# EAGLE design Loconet in-out v3 (EAGLE 7.2.0)
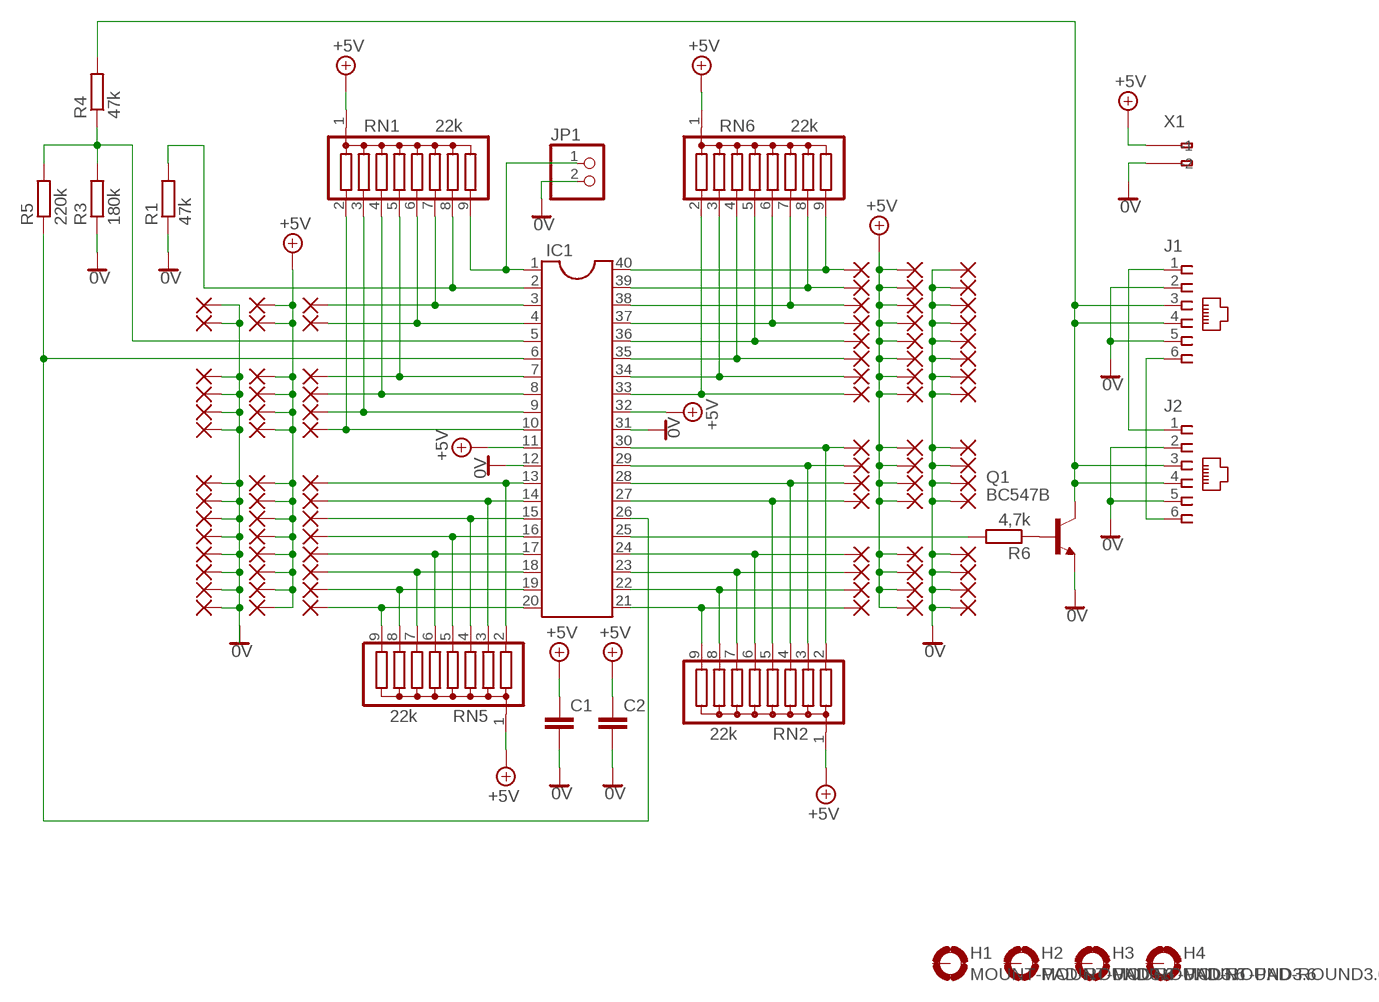
[diagram p0: schematic, sheet 1]

## Parts
0  2,15/1,0  [2,15/1,0]
1  1  2,15/1,0  [2,15/1,0]
2  2,15/1,0  [2,15/1,0]
3  2,15/1,0  [2,15/1,0]
4  2,15/1,0  [2,15/1,0]
5  2,15/1,0  [2,15/1,0]
6  2,15/1,0  [2,15/1,0]
7  2,15/1,0  [2,15/1,0]
8  2,15/1,0  [2,15/1,0]
9  2,15/1,0  [2,15/1,0]
10  2,15/1,0  [2,15/1,0]
11  2,15/1,0  [2,15/1,0]
12  2,15/1,0  [2,15/1,0]
13  2,15/1,0  [2,15/1,0]
14  2,15/1,0  [2,15/1,0]
15  2,15/1,0  [2,15/1,0]
16  2,15/1,0  [2,15/1,0]
17  2,15/1,0  [2,15/1,0]
18  2,15/1,0  [2,15/1,0]
19  2,15/1,0  [2,15/1,0]
20  2,15/1,0  [2,15/1,0]
21  2,15/1,0  [2,15/1,0]
22  2,15/1,0  [2,15/1,0]
23  2,15/1,0  [2,15/1,0]
24  2,15/1,0  [2,15/1,0]
25  2,15/1,0  [2,15/1,0]
26  2,15/1,0  [2,15/1,0]
27  2,15/1,0  [2,15/1,0]
28  2,15/1,0  [2,15/1,0]
29  2,15/1,0  [2,15/1,0]
30  2,15/1,0  [2,15/1,0]
C1  C-EU025-024X044  [C025-024X044]
C2  C-EU025-024X044  [C025-024X044]
H1  MOUNT-PAD-ROUND3.6  [3,6-PAD]
H2  MOUNT-PAD-ROUND3.6  [3,6-PAD]
H3  MOUNT-PAD-ROUND3.6  [3,6-PAD]
H4  MOUNT-PAD-ROUND3.6  [3,6-PAD]
IC1  DIL40  [DIL40]
J1  520250-3  [520250-3]
J2  520250-3  [520250-3]
JP1  PINHD-1X2  [1X02]
PAD1  2,15/1,0  [2,15/1,0]
PAD2  2,15/1,0  [2,15/1,0]
PAD3  2,15/1,0  [2,15/1,0]
PAD4  2,15/1,0  [2,15/1,0]
PAD5  2,15/1,0  [2,15/1,0]
PAD6  2,15/1,0  [2,15/1,0]
PAD7  2,15/1,0  [2,15/1,0]
PAD8  2,15/1,0  [2,15/1,0]
PAD9  2,15/1,0  [2,15/1,0]
PAD10  2,15/1,0  [2,15/1,0]
PAD11  2,15/1,0  [2,15/1,0]
PAD12  2,15/1,0  [2,15/1,0]
PAD13  2,15/1,0  [2,15/1,0]
PAD14  2,15/1,0  [2,15/1,0]
PAD15  2,15/1,0  [2,15/1,0]
PAD16  2,15/1,0  [2,15/1,0]
PAD17  2,15/1,0  [2,15/1,0]
PAD18  2,15/1,0  [2,15/1,0]
PAD19  2,15/1,0  [2,15/1,0]
PAD20  2,15/1,0  [2,15/1,0]
PAD21  2,15/1,0  [2,15/1,0]
PAD22  2,15/1,0  [2,15/1,0]
PAD23  2,15/1,0  [2,15/1,0]
PAD24  2,15/1,0  [2,15/1,0]
PAD25  2,15/1,0  [2,15/1,0]
PAD26  2,15/1,0  [2,15/1,0]
PAD27  2,15/1,0  [2,15/1,0]
PAD28  2,15/1,0  [2,15/1,0]
PAD29  2,15/1,0  [2,15/1,0]
PAD30  2,15/1,0  [2,15/1,0]
PAD33  2,15/1,0  [2,15/1,0]
PAD35  2,15/1,0  [2,15/1,0]
PAD37  2,15/1,0  [2,15/1,0]
PAD39  2,15/1,0  [2,15/1,0]
PAD41  2,15/1,0  [2,15/1,0]
PAD43  2,15/1,0  [2,15/1,0]
PAD52  2,15/1,0  [2,15/1,0]
PAD53  2,15/1,0  [2,15/1,0]
PAD54  2,15/1,0  [2,15/1,0]
PAD55  2,15/1,0  [2,15/1,0]
PAD56  2,15/1,0  [2,15/1,0]
PAD57  2,15/1,0  [2,15/1,0]
PAD58  2,15/1,0  [2,15/1,0]
PAD59  2,15/1,0  [2,15/1,0]
PAD60  2,15/1,0  [2,15/1,0]
PAD61  2,15/1,0  [2,15/1,0]
PAD62  2,15/1,0  [2,15/1,0]
PAD63  2,15/1,0  [2,15/1,0]
PAD64  2,15/1,0  [2,15/1,0]
PAD65  2,15/1,0  [2,15/1,0]
PAD66  2,15/1,0  [2,15/1,0]
PAD67  2,15/1,0  [2,15/1,0]
PAD68  2,15/1,0  [2,15/1,0]
PAD69  2,15/1,0  [2,15/1,0]
PAD70  2,15/1,0  [2,15/1,0]
PAD71  2,15/1,0  [2,15/1,0]
PAD72  2,15/1,0  [2,15/1,0]
PAD73  2,15/1,0  [2,15/1,0]
PAD74  2,15/1,0  [2,15/1,0]
Q1  BC547B  [TO92]
R1  47k  R-EU_0204/7  [0204/7]
R3  180k  R-EU_0204/7  [0204/7]
R4  47k  R-EU_0204/7  [0204/7]
R5  220k  R-EU_0204/7  [0204/7]
R6  4,7k  R-EU_0204/7  [0204/7]
RN1  22k  G08R  [SIL9]
RN2  22k  G08R  [SIL9]
RN5  22k  G08R  [SIL9]
RN6  22k  G08R  [SIL9]
X1  233-102  [233-102]

## Nets
+5V: 0.1(P) C1.1 C2.1 IC1.11 IC1.32 PAD33.1(P) PAD35.1(P) PAD37.1(P) PAD39.1(P) PAD41.1(P) PAD43.1(P) PAD52.1(P) PAD53.1(P) PAD54.1(P) PAD55.1(P) PAD56.1(P) PAD57.1(P) PAD58.1(P) PAD59.1(P) PAD60.1(P) PAD61.1(P) PAD62.1(P) PAD63.1(P) PAD64.1(P) PAD65.1(P) PAD66.1(P) PAD67.1(P) PAD68.1(P) PAD69.1(P) PAD70.1(P) PAD71.1(P) PAD72.1(P) PAD73.1(P) PAD74.1(P) RN1.1 RN2.1 RN5.1 RN6.1 X1.A1(-1)
LN_RECEIVER: IC1.6 IC1.26 R5.1
LOCONET: J1.3 J1.4 J2.3 J2.4 Q1.3(C) R4.2
N$1: IC1.2 R1.2 RN1.8
N$2: IC1.5 R3.2 R4.1 R5.2
N$3: IC1.23 PAD20.1(P) RN2.7
N$4: Q1.2(B) R6.1
N$5: J1.1 J2.1
N$6: IC1.1 JP1.1 RN1.9
N$7: IC1.40 PAD7.1(P) RN6.9
N$8: J1.6 J2.6
N$9: IC1.39 PAD8.1(P) RN6.8
N$10: IC1.3 PAD1.1(P) RN1.7
N$11: IC1.4 PAD2.1(P) RN1.6
N$12: IC1.10 PAD6.1(P) RN1.2
N$13: IC1.9 PAD5.1(P) RN1.3
N$14: IC1.8 PAD4.1(P) RN1.4
N$15: IC1.7 PAD3.1(P) RN1.5
N$16: IC1.33 PAD14.1(P) RN6.2
N$17: IC1.34 PAD13.1(P) RN6.3
N$18: IC1.35 PAD12.1(P) RN6.4
N$19: IC1.36 PAD11.1(P) RN6.5
N$20: IC1.37 PAD10.1(P) RN6.6
N$21: IC1.38 PAD9.1(P) RN6.7
N$22: IC1.21 PAD22.1(P) RN2.9
N$23: IC1.22 PAD21.1(P) RN2.8
N$25: IC1.24 PAD19.1(P) RN2.6
N$26: IC1.27 PAD18.1(P) RN2.5
N$27: IC1.28 PAD17.1(P) RN2.4
N$28: IC1.29 PAD16.1(P) RN2.3
N$29: IC1.30 PAD15.1(P) RN2.2
N$30: IC1.20 PAD23.1(P) RN5.9
N$31: IC1.19 PAD24.1(P) RN5.8
N$32: IC1.18 PAD25.1(P) RN5.7
N$33: IC1.17 PAD26.1(P) RN5.6
N$34: IC1.16 PAD27.1(P) RN5.5
N$35: IC1.15 PAD28.1(P) RN5.4
N$36: IC1.14 PAD29.1(P) RN5.3
N$37: IC1.13 PAD30.1(P) RN5.2
N$38: IC1.25 R6.2
N$42: 1.1(P) 2.1(P) 3.1(P) 4.1(P) 5.1(P) 6.1(P) 7.1(P) 8.1(P) 9.1(P) 10.1(P) 11.1(P) 12.1(P) 13.1(P) 14.1(P) 15.1(P) 16.1(P) 17.1(P) 18.1(P) 19.1(P) 20.1(P) 21.1(P) 22.1(P) 23.1(P) 24.1(P) 25.1(P) 26.1(P) 27.1(P) 28.1(P) 29.1(P) 30.1(P) C1.2 C2.2 IC1.12 IC1.31 J1.2 J1.5 J2.2 J2.5 JP1.2 Q1.1(E) R1.1 R3.1 X1.A2(-2) ; supply symbol labelled 0V
Unconnected: H1.B3,6(MOUNT) H2.B3,6(MOUNT) H3.B3,6(MOUNT) H4.B3,6(MOUNT) X1.B1(B-1) X1.B2(B-2)

## Library data of the parts
0 1-30 PAD1-PAD30 PAD33 PAD35 PAD37 PAD39 PAD41 PAD43 PAD52-PAD74 = wirepad:2,15/1,0: THROUGH-HOLE PAD
C1 C2 = rcl:C-EU: CAPACITOR, European symbol
H1-H4 = holes:MOUNT-PAD-ROUND: MOUNTING PAD, round
IC1 = ic-package:DIL40: Dual In Line
J1 J2 = con-amp:520250-3: AMP connector
JP1 = pinhead:PINHD-1X2: PIN HEADER
Q1 = transistor-npn:BC547*: NPN Transistor
R1 R3-R6 = rcl:R-EU_: RESISTOR, European symbol
RN1 RN2 RN5 RN6 = resistor-sil:G08R: SIL RESISTOR; OC_FARNELL: unknown; OC_NEWARK: unknown
X1 = con-wago255:233-102: WAGO; MPN: 233-102; OC_FARNELL: unknown; OC_NEWARK: 28K9044

## Board
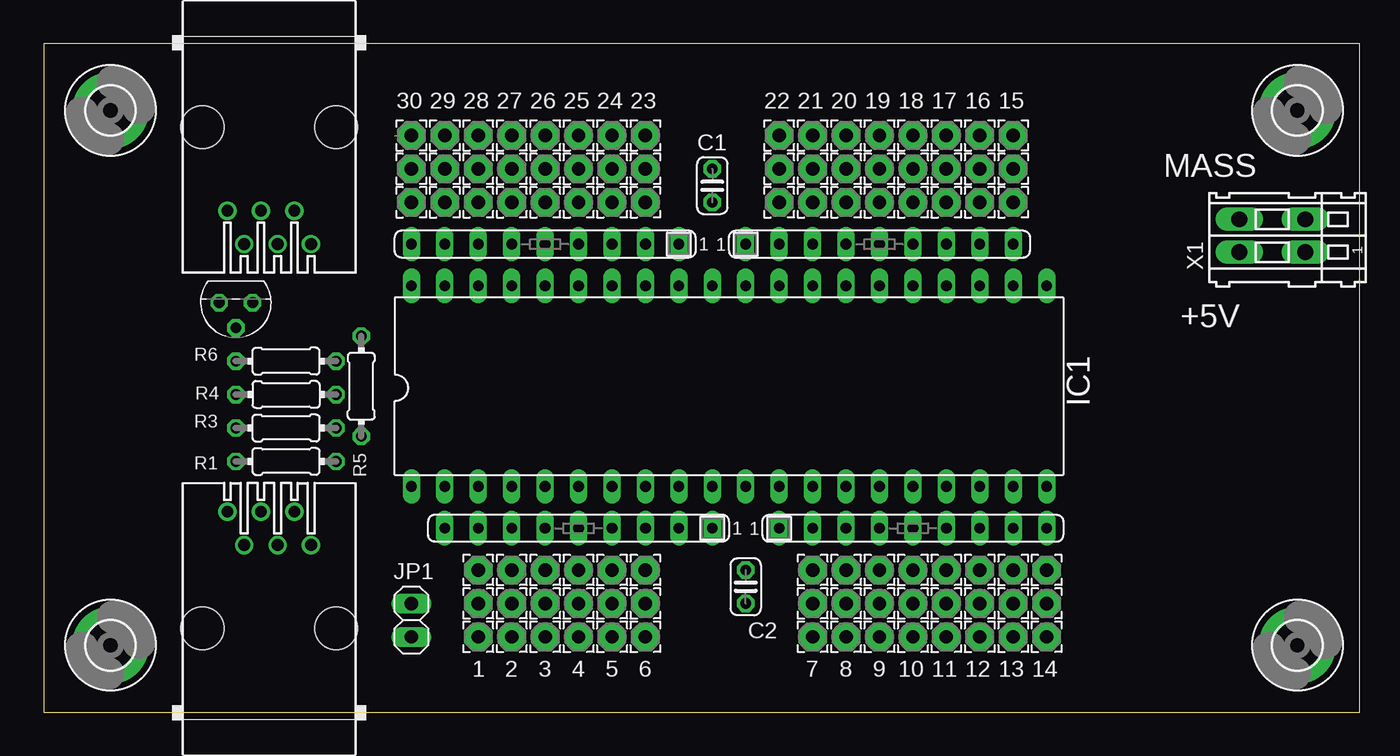
[diagram p1: board, top side]
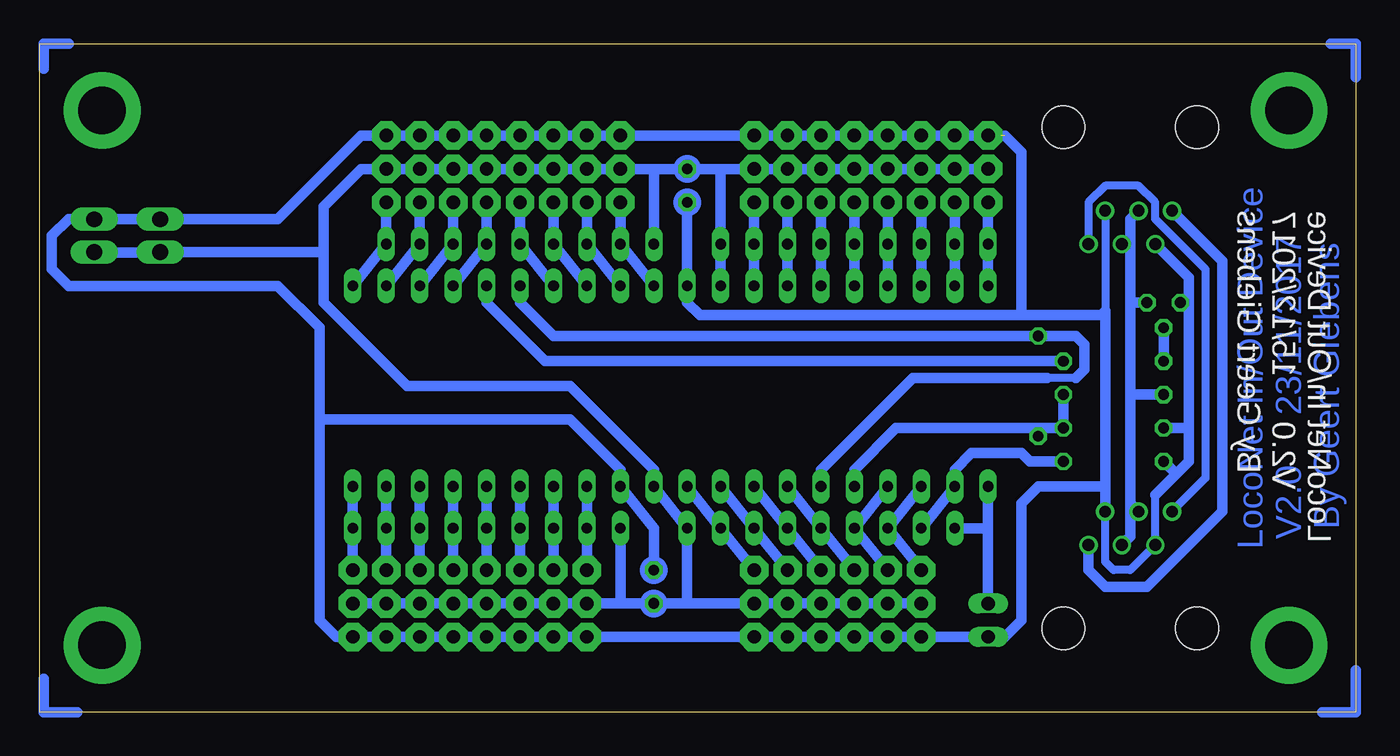
[diagram p2: board, bottom side, seen from below]

Size 100 x 50.79 mm. Coordinates in mm from the lower left corner, seen from the top.
Outline: 0,0 100,0 100,50.79 0,50.79 0,0
Copper layers (1*16): Top 0.035mm / dielectric 1.5mm / Bottom 0.035mm
Design rules "default": minimum track width 10mil, minimum drill 24mil, track to track 8mil, track to pad 8mil, pad to pad 8mil, via to via 8mil, smd to smd 8mil, copper to edge 40mil, drill to drill 8mil, minimum pad ring 10mil, minimum via ring 8mil, stop-mask expansion 4mil, vias tented up to drill 0mil, thermal gap 10mil

### Footprints (pad centres in the part's own frame; a part is rotated, then mirrored left to right if it is on the bottom)
2,15/1,0 = drill 1.016 pad 2.159 octagon: 1 0,0
C025-024X044 = drill 0.813 octagon: 1 -1.27,0; 2 1.27,0
3,6-PAD = drill 3.6 pad 5.842: B3,6 0,0
DIL40 = drill 0.813 long: 1 -24.13,-7.62; 2 -21.59,-7.62; 3 -19.05,-7.62; 4 -16.51,-7.62; 5 -13.97,-7.62; 6 -11.43,-7.62; 7 -8.89,-7.62; 8 -6.35,-7.62; 9 -3.81,-7.62; 10 -1.27,-7.62; 11 1.27,-7.62; 12 3.81,-7.62; 13 6.35,-7.62; 14 8.89,-7.62; 15 11.43,-7.62; 16 13.97,-7.62; 17 16.51,-7.62; 18 19.05,-7.62; 19 21.59,-7.62; 20 24.13,-7.62; 21 24.13,7.62; 22 21.59,7.62; 23 19.05,7.62; 24 16.51,7.62; 25 13.97,7.62; 26 11.43,7.62; 27 8.89,7.62; 28 6.35,7.62; 29 3.81,7.62; 30 1.27,7.62; 31 -1.27,7.62; 32 -3.81,7.62; 33 -6.35,7.62; 34 -8.89,7.62; 35 -11.43,7.62; 36 -13.97,7.62; 37 -16.51,7.62; 38 -19.05,7.62; 39 -21.59,7.62; 40 -24.13,7.62
520250-3 = drill 0.889: 1 -3.175,8.89; 2 -1.905,6.35; 3 -0.635,8.89; 4 0.635,6.35; 5 1.905,8.89; 6 3.175,6.35 | hole 3.251: -5.08,0; 5.08,0
1X02 = drill 1.016 long: 1 -1.27,0; 2 1.27,0
TO92 = drill 0.813 octagon: 1 1.27,0; 2 0,1.905; 3 -1.27,0
0204/7 = drill 0.813 octagon: 1 -3.81,0; 2 3.81,0
SIL9 = drill 0.813 long: 1 -10.16,0; 2 -7.62,0; 3 -5.08,0; 4 -2.54,0; 5 0,0; 6 2.54,0; 7 5.08,0; 8 7.62,0; 9 10.16,0
233-102 = drill 1.2 long: A1 -1.25,2.5; A2 1.25,2.5; B1 -1.25,-2.5; B2 1.25,-2.5

### Placement (x,y rotation side)
0  58.42,8.25 0 top
1  33.02,5.71 0 top
2  35.56,5.71 0 top
3  38.1,5.71 0 top
4  40.64,5.71 0 top
5  43.18,5.71 0 top
6  45.72,5.71 0 top
7  58.42,5.71 0 top
8  60.96,5.71 0 top
9  63.5,5.71 0 top
10  66.04,5.71 0 top
11  68.58,5.71 0 top
12  71.12,5.71 0 top
13  73.66,5.71 0 top
14  76.2,5.71 0 top
15  73.66,43.81 0 top
16  71.12,43.81 0 top
17  68.58,43.81 0 top
18  66.04,43.81 0 top
19  63.5,43.81 0 top
20  60.96,43.81 0 top
21  58.42,43.81 0 top
22  55.88,43.81 0 top
23  45.72,43.81 0 top
24  43.18,43.81 0 top
25  40.64,43.81 0 top
26  38.1,43.81 0 top
27  35.56,43.81 0 top
28  33.02,43.81 0 top
29  30.48,43.81 0 top
30  27.94,43.81 0 top
C1  50.8,40 270 top
C2  53.34,9.52 90 top
H1  5.08,5.08 0 top
H2  95.25,5.08 0 top
H3  5.08,45.72 0 top
H4  95.25,45.72 0 top
IC1  52.07,24.76 0 top
J1  17.14,44.45 180 top
J2  17.14,6.35 0 top
JP1  27.94,6.98 270 top
PAD1  33.02,10.79 0 top
PAD2  35.56,10.79 0 top
PAD3  38.1,10.79 0 top
PAD4  40.64,10.79 0 top
PAD5  43.18,10.79 0 top
PAD6  45.72,10.79 0 top
PAD7  27.94,38.73 0 top
PAD8  30.48,38.73 0 top
PAD9  33.02,38.73 0 top
PAD10  35.56,38.73 0 top
PAD11  38.1,38.73 0 top
PAD12  40.64,38.73 0 top
PAD13  43.18,38.73 0 top
PAD14  45.72,38.73 0 top
PAD15  55.88,38.73 0 top
PAD16  58.42,38.73 0 top
PAD17  60.96,38.73 0 top
PAD18  63.5,38.73 0 top
PAD19  66.04,38.73 0 top
PAD20  68.58,38.73 0 top
PAD21  71.12,38.73 0 top
PAD22  73.66,38.73 0 top
PAD23  76.2,10.79 0 top
PAD24  73.66,10.79 0 top
PAD25  71.12,10.79 0 top
PAD26  68.58,10.79 0 top
PAD27  66.04,10.79 0 top
PAD28  63.5,10.79 0 top
PAD29  60.96,10.79 0 top
PAD30  58.42,10.79 0 top
PAD33  63.5,8.25 0 top
PAD35  68.58,8.25 0 top
PAD37  73.66,8.25 0 top
PAD39  71.12,8.25 0 top
PAD41  66.04,8.25 0 top
PAD43  60.96,8.25 0 top
PAD52  76.2,8.25 0 top
PAD53  73.66,41.28 0 top
PAD54  71.12,41.28 0 top
PAD55  68.58,41.28 0 top
PAD56  66.04,41.28 0 top
PAD57  63.5,41.28 0 top
PAD58  60.96,41.28 0 top
PAD59  58.42,41.28 0 top
PAD60  55.88,41.28 0 top
PAD61  45.72,41.28 0 top
PAD62  43.18,41.28 0 top
PAD63  40.64,41.28 0 top
PAD64  38.1,41.28 0 top
PAD65  35.56,41.28 0 top
PAD66  33.02,41.28 0 top
PAD67  30.48,41.28 0 top
PAD68  27.94,41.28 0 top
PAD69  45.72,8.25 0 top
PAD70  43.18,8.25 0 top
PAD71  40.64,8.25 0 top
PAD72  38.1,8.25 0 top
PAD73  35.56,8.25 0 top
PAD74  33.02,8.25 0 top
Q1  14.61,31.11 180 top
R1  18.41,19.05 0 top
R3  18.41,21.59 0 top
R4  18.41,24.13 180 top
R5  24.13,24.76 270 top
R6  18.41,26.67 0 top
RN1  40.64,13.97 180 top
RN2  63.5,35.56 0 top
RN5  66.04,13.97 0 top
RN6  38.1,35.56 180 top
X1  93.34,36.19 90 top

### Tracks (layer width: path | path; a pad name or v marks a point on that pad's centre or on a via)
+5V
  Bottom 0.813: IC1.32 RN6.1 48.26,41.28 | PAD68.1 PAD67.1 PAD66.1 PAD65.1 PAD64.1 PAD63.1 PAD62.1 PAD61.1 48.26,41.28 | PAD52.1 PAD37.1 PAD39.1 PAD35.1 PAD41.1 PAD33.1 PAD43.1 0.1 55.88,8.25 | PAD74.1 PAD73.1 PAD72.1 PAD71.1 PAD70.1 PAD69.1 50.8,8.25 | 48.26,41.28 C1.1 53.34,41.28 | 53.34,41.28 PAD60.1 PAD59.1 PAD58.1 PAD57.1 PAD56.1 PAD55.1 PAD54.1 PAD53.1 75.56,41.28 78.42,38.42 78.42,34.92 | RN2.1 53.34,41.28 | RN5.1 55.88,8.25 | 50.8,8.25 RN1.1 IC1.11 53.34,18.42 59.69,24.76 72.07,24.76 78.42,31.11 78.42,34.92 | 50.8,8.25 C2.1 55.88,8.25 | X1.A1 78.44,34.94 78.42,34.92
LN_RECEIVER
  Bottom 0.61: 21.27,25.4 23.5,25.4
  Bottom 0.813: IC1.6 40.64,18.42 33.66,25.4 23.5,25.4 | 21.27,25.4 20.64,26.04 20.64,27.94 21.27,28.57 R5.1 60.96,28.57 63.5,31.11 IC1.26
LOCONET
  Bottom 0.813: J2.3 17.14,15.88 | 17.14,15.88 17.14,24.13 | 17.14,24.13 17.14,31.11 | 17.14,31.11 17.14,35.56 | 17.14,35.56 17.14,37.47 J1.4 | J1.3 17.14,35.56 | J2.4 17.14,13.34 17.14,15.88 | R4.2 17.14,24.13 | Q1.3 17.14,31.11
N$1
  Bottom 0.813: RN1.8 IC1.2 30.48,18.42 29.21,19.68 25.4,19.68 24.77,19.05 R1.2
N$2
  Bottom 0.813: IC1.5 38.1,18.42 34.92,21.59 24.13,21.59 | R4.1 R3.2 24.13,21.59 | R5.2 24.13,21.59
N$3
  Bottom 0.813: IC1.23 RN2.7 PAD20.1
N$4
  Bottom 0.813: R6.1 Q1.2
N$5
  Bottom 0.61: J1.1 20.32,38.73 19.05,40 16.51,40 15.24,38.73 15.24,37.47 11.43,33.66 11.43,17.78 J2.1
N$6
  Bottom 0.813: JP1.1 27.94,13.97 | 27.94,13.97 IC1.1 | RN1.9 27.94,13.97
N$7
  Bottom 0.813: IC1.40 RN6.9 PAD7.1
N$8
  Bottom 0.813: J1.6 10.16,34.29 10.16,15.24 15.88,9.52 19.05,9.52 20.32,10.79 J2.6
N$9
  Bottom 0.813: IC1.39 RN6.8 PAD8.1
N$10
  Bottom 0.813: IC1.3 RN1.7 PAD1.1
N$11
  Bottom 0.813: IC1.4 RN1.6 PAD2.1
N$12
  Bottom 0.813: IC1.10 RN1.2 PAD6.1
N$13
  Bottom 0.813: IC1.9 RN1.3 PAD5.1
N$14
  Bottom 0.813: IC1.8 RN1.4 PAD4.1
N$15
  Bottom 0.813: IC1.7 RN1.5 PAD3.1
N$16
  Bottom 0.813: IC1.33 RN6.2 PAD14.1
N$17
  Bottom 0.813: IC1.34 RN6.3 PAD13.1
N$18
  Bottom 0.813: IC1.35 RN6.4 PAD12.1
N$19
  Bottom 0.813: IC1.36 RN6.5 PAD11.1
N$20
  Bottom 0.813: IC1.37 RN6.6 PAD10.1
N$21
  Bottom 0.813: IC1.38 RN6.7 PAD9.1
N$22
  Bottom 0.813: IC1.21 RN2.9 PAD22.1
N$23
  Bottom 0.813: IC1.22 RN2.8 PAD21.1
N$25
  Bottom 0.813: IC1.24 RN2.6 PAD19.1
N$26
  Bottom 0.813: IC1.27 RN2.5 PAD18.1
N$27
  Bottom 0.813: IC1.28 RN2.4 PAD17.1
N$28
  Bottom 0.813: IC1.29 RN2.3 PAD16.1
N$29
  Bottom 0.813: IC1.30 RN2.2 PAD15.1
N$30
  Bottom 0.813: IC1.20 RN5.9 PAD23.1
N$31
  Bottom 0.813: IC1.19 RN5.8 PAD24.1
N$32
  Bottom 0.813: IC1.18 RN5.7 PAD25.1
N$33
  Bottom 0.813: IC1.17 RN5.6 PAD26.1
N$34
  Bottom 0.813: IC1.16 RN5.5 PAD27.1
N$35
  Bottom 0.813: IC1.15 RN5.4 PAD28.1
N$36
  Bottom 0.813: IC1.14 RN5.3 PAD29.1
N$37
  Bottom 0.813: IC1.13 RN5.2 PAD30.1
N$38
  Bottom 0.813: R6.2 61.59,26.67 66.04,31.11 IC1.25
N$39
  Bottom 0.813: 0,48.26 0,50.8 1.27,50.8 1.91,50.8
N$40
  Bottom 0.813: 95.89,34.92 90.81,34.92
N$41
  Bottom 0.813: 97.79,50.8 99.69,50.8 99.69,48.89
N$42  (1 unrouted)
  Bottom 0.61: J1.2 19.05,30.48 | J2.5 19.05,11.43 18.41,10.79 17.14,10.79 J2.2 15.24,16.51
  Bottom 0.813: 26.67,43.81 25.4,42.55 25.4,30.16 | 96.52,37.47 97.79,37.47 99.06,36.19 99.06,33.66 97.79,32.39 81.92,32.39 78.74,29.21 78.74,22.22 | C1.2 IC1.31 50.8,31.11 49.85,30.16 25.4,30.16 | C2.2 53.34,13.97 IC1.12 55.88,18.42 59.69,22.22 78.74,22.22 | 25.4,30.16 19.37,30.16 19.05,30.48 19.05,17.14 | 26.99,43.81 30.1 29.1 28.1 27.1 26.1 25.1 24.1 23.1 22.1 21.1 20.1 19.1 18.1 17.1 16.1 15.1 75.56,43.81 81.92,37.47 90.83,37.47 | 78.74,22.22 78.74,6.98 77.47,5.71 14.1 13.1 12.1 11.1 10.1 9.1 8.1 7.1 46.35,5.71 | 12.7,31.11 12.7,33.02 J1.5 | Q1.1 12.7,31.11 | 6.1 5.1 4.1 3.1 2.1 1.1 JP1.2 26.67,5.71 25.4,6.98 25.4,15.88 24.13,17.14 19.05,17.14 | J2.5 19.05,17.14 | 12.7,31.11 12.7,21.59 | 12.7,21.59 12.7,19.05 13.65,18.1 | 13.65,18.1 15.24,16.51 | R3.1 12.7,21.59 | 90.83,37.47 X1.A2 | 95.89,37.47 90.83,37.47 | R1.1 13.65,18.1
  Bottom 1.27: 6.1 46.35,5.71
N$43
  Bottom 0.813: 99.69,2.54 99.69,0 97.16,0
N$44
  Bottom 0.813: 0,3.18 0,0 2.54,0
(copper drawn outside any net)
  shapes: Bottom circle x12

### Text on the board
Bottom: LocoNet In/Out Device / V2.0 23/11/2017 / By Geert Giebens
tNames: MASS | +5V
bNames: LocoNet In/Out Device / V2.0 15/12/2017 / By Geert Giebens